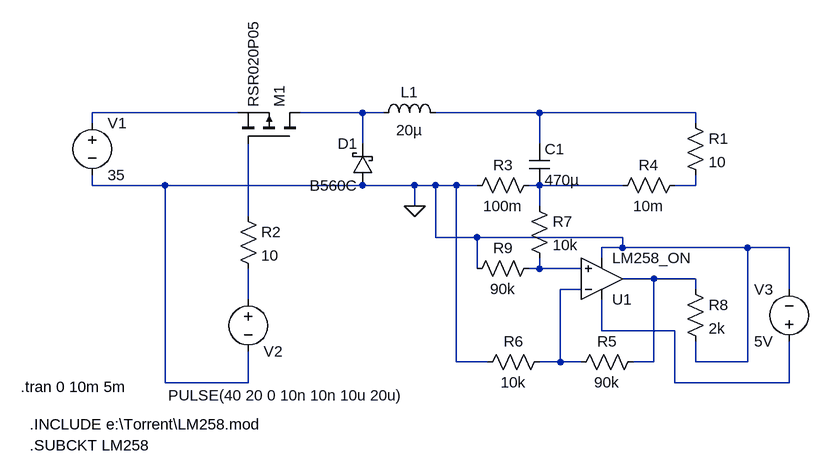
[diagram p0: schematic Buck_Low_Side_Curr_Sense_LM358.asc]
Buck_Low_Side_Curr_Sense_LM358.asc, the LTspice schematic file:
Version 4
SHEET 1 1168 680
WIRE 16 112 -208 112
WIRE 208 112 112 112
WIRE 240 112 208 112
WIRE 480 112 320 112
WIRE 720 112 480 112
WIRE -208 128 -208 112
WIRE 720 128 720 112
WIRE 208 160 208 112
WIRE 480 160 480 112
WIRE -208 224 -208 208
WIRE -96 224 -208 224
WIRE 208 224 -96 224
WIRE 288 224 208 224
WIRE 320 224 288 224
WIRE 352 224 320 224
WIRE 384 224 352 224
WIRE 480 224 464 224
WIRE 608 224 480 224
WIRE 720 224 720 208
WIRE 720 224 688 224
WIRE 288 256 288 224
WIRE 480 256 480 224
WIRE 32 272 32 160
WIRE 320 304 320 224
WIRE 384 304 320 304
WIRE 608 304 384 304
WIRE 608 320 608 304
WIRE 608 320 576 320
WIRE 800 320 608 320
WIRE 864 320 800 320
WIRE 576 336 576 320
WIRE 384 352 384 304
WIRE 480 352 480 336
WIRE 480 352 464 352
WIRE 544 352 480 352
WIRE 656 368 608 368
WIRE 720 368 656 368
WIRE 544 384 512 384
WIRE 720 384 720 368
WIRE 864 384 864 320
WIRE 32 400 32 352
WIRE 576 448 576 400
WIRE 688 448 576 448
WIRE 352 496 352 224
WIRE 400 496 352 496
WIRE 512 496 512 384
WIRE 512 496 480 496
WIRE 544 496 512 496
WIRE 656 496 656 368
WIRE 656 496 624 496
WIRE 720 496 720 464
WIRE 800 496 800 320
WIRE 800 496 720 496
WIRE -96 528 -96 224
WIRE 32 528 32 480
WIRE 32 528 -96 528
WIRE 688 528 688 448
WIRE 864 528 864 464
WIRE 864 528 688 528
FLAG 288 256 0
SYMBOL ind 224 128 R270
WINDOW 0 32 56 VTop 2
WINDOW 3 5 56 VBottom 2
SYMATTR InstName L1
SYMATTR Value 20µ
SYMBOL schottky 224 224 R180
WINDOW 0 24 64 Left 2
WINDOW 3 24 0 Left 2
SYMATTR InstName D1
SYMATTR Value B560C
SYMATTR Description Diode
SYMATTR Type diode
SYMBOL pmos 112 160 M270
SYMATTR InstName M1
SYMATTR Value RSR020P05
SYMBOL cap 464 160 R0
SYMATTR InstName C1
SYMATTR Value 470µ
SYMBOL voltage -208 112 R0
WINDOW 123 0 0 Left 2
WINDOW 39 0 0 Left 2
SYMATTR InstName V1
SYMATTR Value 35
SYMBOL res 704 112 R0
SYMATTR InstName R1
SYMATTR Value 10
SYMBOL res 16 256 R0
SYMATTR InstName R2
SYMATTR Value 10
SYMBOL voltage 32 384 R0
WINDOW 0 24 96 Left 2
WINDOW 3 -123 163 Left 2
WINDOW 123 0 0 Left 2
WINDOW 39 0 0 Left 2
SYMATTR InstName V2
SYMATTR Value PULSE(40 20 0 10n 10n 10u 20u)
SYMBOL res 480 208 R90
WINDOW 0 0 56 VBottom 2
WINDOW 3 32 56 VTop 2
SYMATTR InstName R3
SYMATTR Value 100m
SYMBOL res 704 208 R90
WINDOW 0 0 56 VBottom 2
WINDOW 3 32 56 VTop 2
SYMATTR InstName R4
SYMATTR Value 10m
SYMBOL res 640 480 R90
WINDOW 0 0 56 VBottom 2
WINDOW 3 32 56 VTop 2
SYMATTR InstName R5
SYMATTR Value 90k
SYMBOL res 496 480 R90
WINDOW 0 0 56 VBottom 2
WINDOW 3 32 56 VTop 2
SYMATTR InstName R6
SYMATTR Value 10k
SYMBOL res 704 368 R0
SYMATTR InstName R8
SYMATTR Value 2k
SYMBOL voltage 864 480 R180
WINDOW 0 24 96 Left 2
WINDOW 3 24 16 Left 2
WINDOW 123 0 0 Left 2
WINDOW 39 0 0 Left 2
SYMATTR InstName V3
SYMATTR Value 5V
SYMBOL res 464 240 R0
SYMATTR InstName R7
SYMATTR Value 10k
SYMBOL res 480 336 R90
WINDOW 0 0 56 VBottom 2
WINDOW 3 32 56 VTop 2
SYMATTR InstName R9
SYMATTR Value 90k
SYMBOL Opamps\\opamp2 576 432 M180
SYMATTR InstName U1
SYMATTR Value LM258_ON
TEXT -318 534 Left 2 !.tran 0 10m 5m
TEXT -304 592 Left 2 !.INCLUDE e:\\Torrent\\LM258.mod
TEXT -304 624 Left 2 !.SUBCKT LM258

The netlist it stands for:
* Buck_Low_Side_Curr_Sense_LM358.asc
L1 N002 N003 20µ
D1 0 N002 B560C
M1 N002 N006 N001 N001 RSR020P05
C1 N003 N004 470µ
V1 N001 0 35
R1 N003 N005 10
R2 N006 N010 10
V2 N010 0 PULSE(40 20 0 10n 10n 10u 20u)
R3 N004 0 100m
R4 N005 N004 10m
R5 N008 N009 90k
R6 N009 0 10k
R8 N008 0 2k
V3 N011 0 5V
R7 N004 N007 10k
R9 N007 0 90k
XU1 N007 N009 N011 0 N008 LM258_ON  ; pins In+ In- V+ V- OUT
.model D D
.lib standard.dio
.model NMOS NMOS
.model PMOS PMOS
.lib standard.mos
.tran 0 10m 5m
.INCLUDE e:\Torrent\LM258.mod
.SUBCKT LM258
.backanno
.end